# Altium schematic sheet SensorCheck.SchDoc
size A
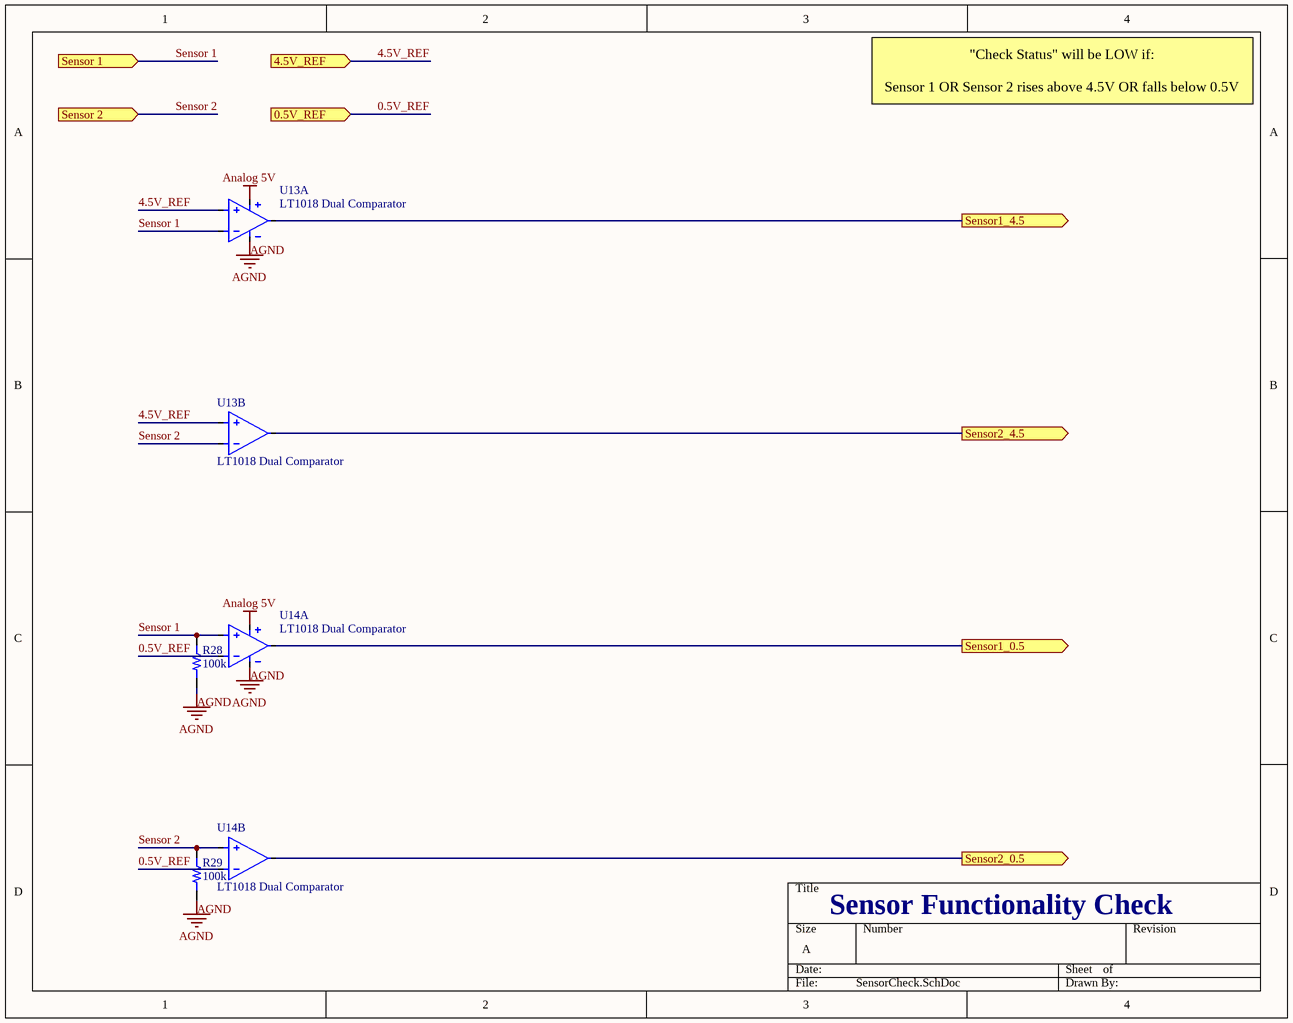
[diagram p0: SensorCheck.SchDoc]

## Parts
R28  resistance: 100k  [0603]  (hidden comment: resistor)
R29  resistance: 100k  [0603]  (hidden comment: resistor)
U13  LT1018 Dual Comparator  [SOIC-8]  (parts A,B of 2)
U14  LT1018 Dual Comparator  [SOIC-8]  (parts A,B of 2)

## Ports
0.5V_REF (in), 4.5V_REF (in), Sensor1_0.5 (out), Sensor1_4.5 (out), Sensor2_0.5 (out), Sensor2_4.5 (out), Sensor 1 (in), Sensor 2 (in)

## Nets
AGND: R28.1 R29.1 U13.2(V-) U14.2(V-)
Analog 5V: U13.6(V+) U14.6(V+)
0.5V_REF: U14.4(-IN_B) U14.8(-IN_A) ; port 0.5V_REF
4.5V_REF: U13.1(+IN_A) U13.3(+IN_B) ; port 4.5V_REF
Sensor1_0.5: U14.7(OUT_A) ; port Sensor1_0.5
Sensor1_4.5: U13.7(OUT_A) ; port Sensor1_4.5
Sensor2_0.5: U14.5(OUT_B) ; port Sensor2_0.5
Sensor2_4.5: U13.5(OUT_B) ; port Sensor2_4.5
Sensor 1: R28.2 U13.8(-IN_A) U14.1(+IN_A) ; port Sensor 1
Sensor 2: R29.2 U13.4(-IN_B) U14.3(+IN_B) ; port Sensor 2

## Notes on the sheet
- "Check Status" will be LOW if:
  Sensor 1 OR Sensor 2 rises above 4.5V OR falls below 0.5V
- Sensor Functionality Check

## Library data of the parts
R28 R29 = 1: id: 1; name: 0603 Resistor; percent tolerance: 5; package: 0603; quantity: 0
U13 = 7: id: 7; name: LT1018CS8#PBF; Comparator Designator: SC1; quantity: 0; link: https://www.digikey.com/product-detail/en/lin
U14 = 7: id: 7; name: LT1018CS8#PBF; Comparator Designator: SC2; quantity: 0; link: https://www.digikey.com/product-detail/en/lin